# Altium schematic sheet sensorconn.schdoc: Sensor Connectors
size 431 x 279 mm; DrawnBy: D. Bruey, M. Ciuffo; Organization: Synapse Product Development, LLC.; Address1: 1511 6th Ave., Suite 400; Address2: Seattle, Washington 98101; Address3: 206.381.0898; Address4: www.synapse.com; DocumentNumber: 2; SheetNumber: 2; SheetTotal: 3; PageSetup: Record=PageOptions|CenterHorizontal=True|CenterVertical=True|PrintScale=1.06|XCorrection=1.00|YCorrection=1.00|PrintKind=1|BorderSize=5000000|LeftOffset=0|BottomOffset=0|Orientation=2|PaperLength=4318|PaperWidth=2794|Scale=100|PaperSource=7|PrintQuality=200|MediaType=1|DitherType=10|PrintScaleMode=1|PaperKind=11x17|PaperIndex=3
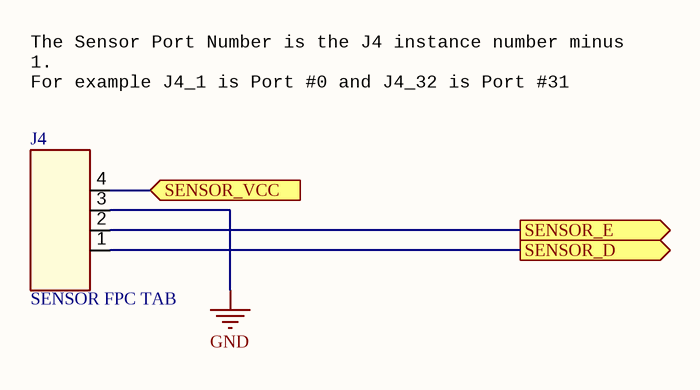
[diagram p0: sensorconn.schdoc]

## Parts
J4  SENSOR FPC TAB  [WATCHMAN_CUSTOM_ZIF_4_PADS]  (no BOM)

## Ports
SENSOR_D (out), SENSOR_E (out), SENSOR_VCC (in)

## Nets
GND: J4.3
SENSOR_D: J4.1 ; port SENSOR_D
SENSOR_E: J4.2 ; port SENSOR_E
SENSOR_VCC: J4.4 ; port SENSOR_VCC

## Notes on the sheet
- The Sensor Port Number is the J4 instance number minus 1.
  For example J4_1 is Port #0 and J4_32 is Port #31
- Design Notes:
- Layout Notes:
- Project:
- Sheet Title:
- PCBA:
- PROPRIETARY AND CONFIDENTIAL
- Drawn by:
- Schematic Part Number:
- Schematic Revision:
- Date:
- Sheet:
- /

## Library data of the parts
J4 = Watchman_Sensor_FPC_Tab: WATCHMAN SENSOR FPC TABS; part_type: connector; id: 1609; mfg: Custom; positions: 4; TableName: viewAltiumConnectors; mfg_pn: Watchman_Sensor_FPC_Tab; dist_pn: Watchman_Sensor_FPC_Tab; status: Unknown